# Altium schematic sheet SHDN-BSPD-S04-V00-BSPDWindowComparitor.SchDoc: Window Comparitor
size A3; DrawnBy: Jonn Dillon; DocumentNumber: 4; Revision: 01; SheetNumber: 4; SheetTotal: 12
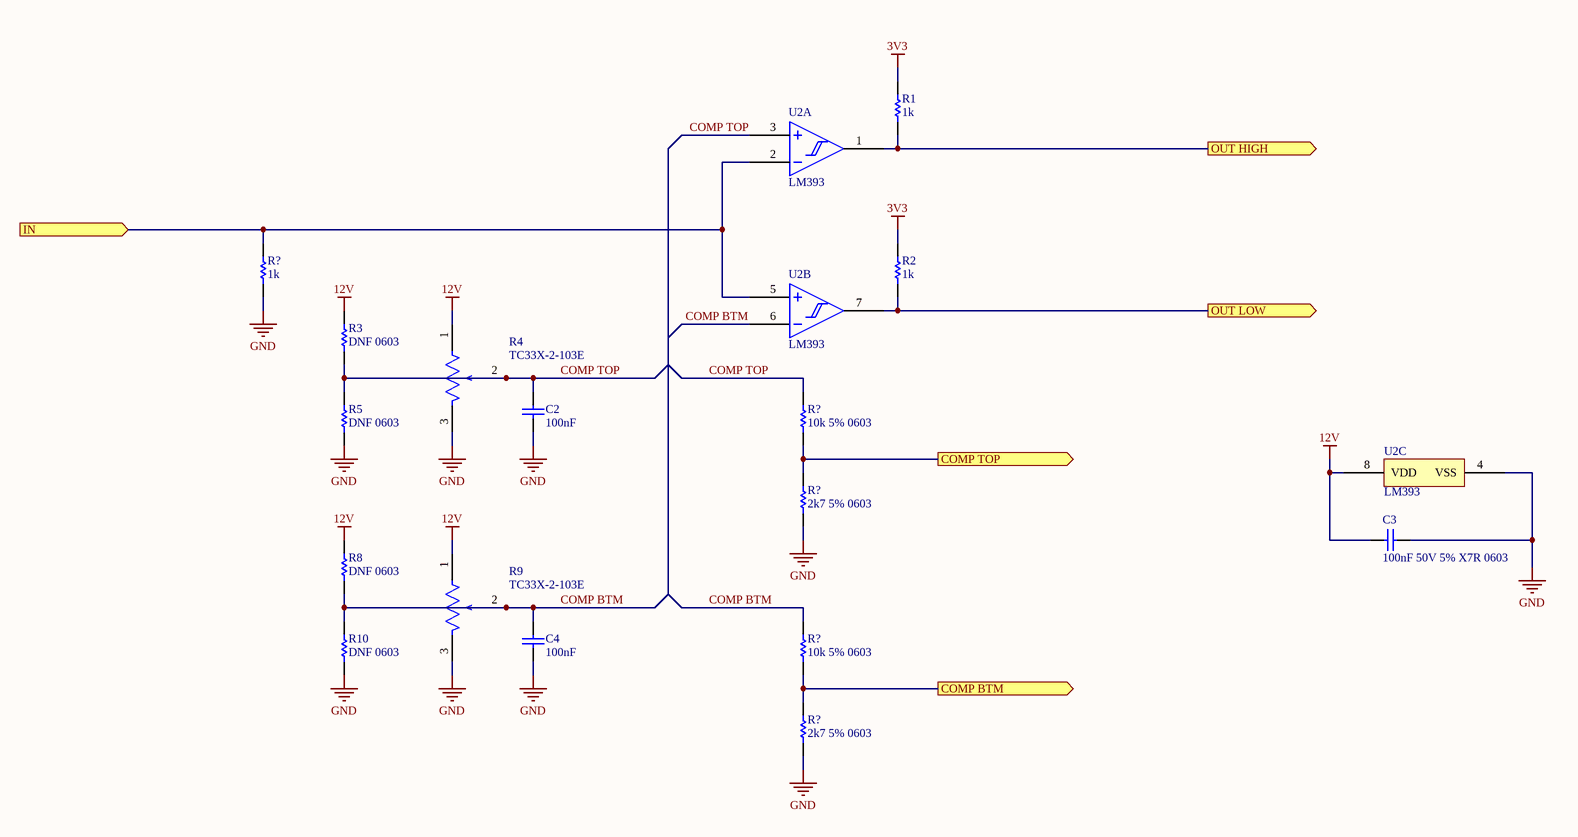
[diagram p0: SHDN-BSPD-S04-V00-BSPDWindowComparitor.SchDoc]

## Parts
(Parts that share a designator on the sheet are numbered #1, #2 ... from top to bottom, then left to right.)
C2  100nF  [Cap_Ceramic_0603]
C3  100nF 50V 5% X7R 0603  [Cap_Ceramic_0603]
C4  100nF  [Cap_Ceramic_0603]
R1  1k  [Res_ThinFilm_0603]
R2  1k  [Res_ThinFilm_0603]
R3  DNF 0603  [Res_ThinFilm_0603]
R4  TC33X-2-103E
R5  DNF 0603  [Res_ThinFilm_0603]
R8  DNF 0603  [Res_ThinFilm_0603]
R9  TC33X-2-103E
R10  DNF 0603  [Res_ThinFilm_0603]
R?#1  1k  [Res_ThinFilm_0603]
R?#2  10k 5% 0603  [Res_ThinFilm_0603]
R?#3  2k7 5% 0603  [Res_ThinFilm_0603]
R?#4  10k 5% 0603  [Res_ThinFilm_0603]
R?#5  2k7 5% 0603  [Res_ThinFilm_0603]
U2  LM393  [TSSOP-8]  (parts A,B,C of 3)

## Ports
COMP BTM (out), COMP TOP (out), IN (in), OUT HIGH (out), OUT LOW (out)

## Nets
3V3: R1.2 R2.2
12V: C3.1 R3.2 R4.1 R8.2 R9.1 U2.8(VDD)
GND: C2.1 C3.2 C4.1 R4.3 R5.1 R9.3 R10.1 R?#1.1 R?#3.1 R?#5.1 U2.4(VSS)
COMP BTM: C4.2 R8.1 R9.2 R10.2 R?#4.1 U2.6(IN2-)
COMP BTM: R?#4.2 R?#5.2 ; port COMP BTM  [a separate net that carries the same name]
COMP TOP: C2.2 R3.1 R4.2 R5.2 R?#2.1 U2.3(IN1+)
COMP TOP: R?#2.2 R?#3.2 ; port COMP TOP  [a separate net that carries the same name]
IN: R?#1.2 U2.2(IN1-) U2.5(IN2+) ; port IN
OUT HIGH: R1.1 U2.1(OUT1) ; port OUT HIGH
OUT LOW: R2.1 U2.7(OUT1) ; port OUT LOW

## Notes on the sheet
- Revision History:
- Sheet Title:
- Rev
- Date
- Description
- Project:
- Size:
- Drawn By:
- A3
- Number:
- Revision:
- Sheet
- Version:
- of
- QUT Motorsport
- O-120, Gardens Point
- 2 George Street
- Brisbane, QLD 4000
- Australia
- Print Date:
- Print Time:
- File Name:

## Library data of the parts
C2-C4 = 100nF 50V 5% X7R 0603: Capacitor, Ceramic, SMD, 100nF, 50V, 5%, X7R, 0603
R1 R2 R?#1 = 1k 5% 0603: Resistor, SMD, 1k, 0.1W, 5%, 0603
R3 R5 R8 R10 = DNF 0603: Resistor, SMD, DNF, 0.1W, 0603
R4 R9 = TC33X-2-103E: 10 kOhms 0.1W, 1/10W J Lead Surface Mount Trimmer Potentiometer Cermet 1 Turn Top Adjustment
R?#2 R?#4 = 10k 5% 0603: Resistor, SMD, 10k, 0.1W, 5%, 0603
R?#3 R?#5 = 2k7 5% 0603: Resistor, SMD, 2k7, 0.1W, 5%, 0603
U2 = LM393: General Purpose Comparitor 2 Circuit 8-SOIC